# Altium schematic sheet Power.SchDoc
size A; SheetNumber: 8; SheetTotal: 8
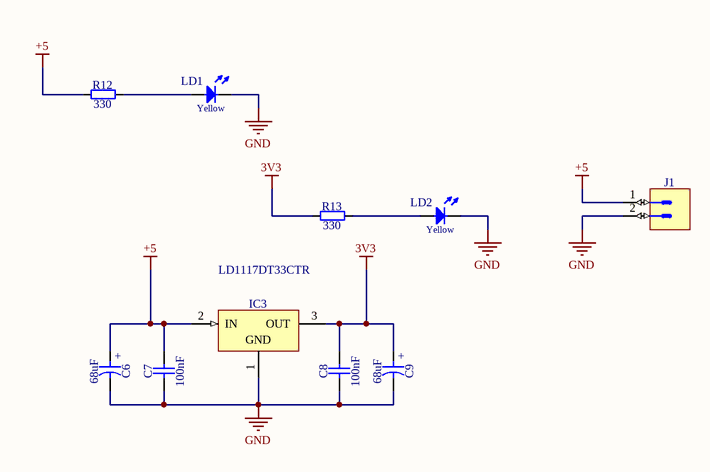
[diagram p0: Power.SchDoc]

## Parts
C6  68uF  [CAPAE660X540N]
C7  100nF  [CAPC2012X135N]
C8  100nF  [CAPC2012X135N]
C9  68uF  [CAPAE660X540N]
IC3  LD1117DT33CTR  [TO228P972X240-3N-R540X510]
J1  Header 2  [JST_B2B-XH-A(LF)(SN)]  (value not drawn)
LD1  Yellow  [LED_3MM_YELLOW_1C-2A]
LD2  Yellow  [LED_3MM_YELLOW_1C-2A]
R12  330  [RESC2012X60N]
R13  330  [RESC2012X60N]

## Nets
3V3: C8.2 C9.1 IC3.3(OUT) R13.1
+5: C6.1 C7.2 IC3.2(IN) J1.1 R12.1
GND: C6.2 C7.1 C8.1 C9.2 IC3.1(GND) J1.2 LD1.1(C) LD2.1(C)
NetLD1_2: LD1.2(A) R12.2
NetLD2_2: LD2.2(A) R13.2

## Notes on the sheet
- (in symbol CAE660-540_220UF_6.3V_20%) +

## Library data of the parts
C6 C9 = CAE660-540_220UF_6.3V_20%: Polarised capacitor; Part Description: Aluminum Electrolytic SMT Capacitor; Manufacturer: PANASONIC; Manufacturer Part Number: EEEFK0J221AP; Voltage: 6.3V; Tolerance: ±20%; Part Number: CAE660-540_220UF_6.3V_20%; Component Kind: Standard; Component Type: Standard; Pin Count: 2; Value: 68uF; Status: Not Recommended; Case: D; Mounted: Yes; Socket: No; SMD: Yes; Sense: No; ComponentHeight: 5.8mm; HelpURL: \\cern.ch\dfs\Applications\Altium\Datasheets\CAE_PANASONIC_FK-V.pdf; Author: CERN DEM JLC; CreateDate: 12/3/2007; LatestRevisionDate: 11/5/2014
C7 C8 = CC0805_100NF_50V_10%_X7R: Non-polarised capacitor; Part Description: SMD Multilayer Chip Ceramic Capacitor; Manufacturer: GENERIC; Manufacturer1 Part Number: C2012X7R1H104K085; Voltage: 50V; TC: X7R; Tolerance: ±10%; Part Number: CC0805_100NF_50V_10%_X7R; Component Kind: Standard; Component Type: Standard; Pin Count: 2; Value: 100nF; Status: None; Manufacturer Part Number: CC0805_100NF_50V_10%_X7R; Case: 0805; Mounted: Yes; Socket: No; SMD: Yes; Sense: No; Manufacturer1 Example: TDK; Manufacturer1 ComponentHeight: 1mm; HelpURL: \\cern.ch\dfs\Applications\Altium\Datasheets\CC0805_X7R_TDK_C.pdf; Author: CERN DEM JLC; CreateDate: 12/3/2007; LatestRevisionDate: 4/22/2015
IC3 = LD1117DT33CTR: 3-Terminal Regulator 1=GND 2=IN 3=OUT; Part Description: 3.3V 800mA Low drop fixed and adjustable positive voltage regulators; Manufacturer: ST MICROELECTRONICS; PressFit: No; Bonding: No; Part Number: LD1117DT33CTR; Component Kind: Standard; Component Type: Standard; Device: LD1117DT33CTR; PackageDescription: TO-252 DPAK TO, 2.28mm Pitch; 2 Pin, 9.725mm L X 6.10mm W X 2.40mm H body, IPC Medium Density; Manufacturer Part Number: LD1117DT33CTR; Pin Count: 3; Case: DPAK; Mounted: Yes; Socket: No; SMD: Yes; Sense: No; ComponentHeight: 2.4mm; HelpURL: \\cern.ch\dfs\Applications\Altium\Datasheets\LD1117DT33CTR.pdf; Author: CERN DEM JLC; CreateDate: 6/8/2011; LatestRevisionDate: 6/8/2011
J1 = JST_B2B-XH-A(LF)(SN): Connector 2 Male; Part Description: 2 Contacts, 2.5mm Pitch, Top Entry Type Shrouded Header; Manufacturer: JST (JAPAN SOLDERLESS TERMINALS); PressFit: No; Part Number: JST_B2B-XH-A(LF)(SN); Component Kind: Standard; Component Type: Standard; Pin Count: 2; Family: Header 2; Mounted: Yes; Socket: No; SMD: No; Sense: No; Status: None; Manufacturer Part Number: B2B-XH-A(LF)(SN); ComponentHeight: 7mm; HelpURL: \\cern.ch\dfs\Applications\Altium\Datasheets\JST_B2B-XH-A(LF)(SN).pdf; Author: CERN DEM JLC; CreateDate: 8/14/2014; LatestRevisionDate: 8/14/2014
LD1 LD2 = LED_AVAGO_HLMP-1719: LED Yellow 1C 2A; Part Description: 3mm Yellow LED; Manufacturer: AVAGO TECHNOLOGIES; PressFit: No; Bonding: No; Part Number: LED_AVAGO_HLMP-1719; Component Kind: Standard; Component Type: Standard; Color: Yellow; PackageDescription: LED, Yellow, Body Dia. 3.43 mm, Pin spacing 2.54mm; Manufacturer Part Number: HLMP-1719; Pin Count: 2; Mounted: Yes; Socket: No; SMD: No; Sense: No; ComponentHeight: 6.35mm(min); HelpURL: \\cern.ch\dfs\Applications\Altium\Datasheets\LED_AVAGO_HLMP-1719.pdf; Author: CERN DEM JLC; CreateDate: 6/12/2008; LatestRevisionDate: 3/17/2010
R12 R13 = R0805_24K_1%_0.125W_100PPM: Resistor - 1%; Part Description: General Purpose Thick Film Chip Resistor; Manufacturer: GENERIC; Manufacturer1 Part Number: NRC10F2402TRF; Power: 0.125W; TC: ±100ppm/°C; PressFit: No; Part Number: R0805_24K_1%_0.125W_100PPM; Component Kind: Standard; Component Type: Standard; Pin Count: 2; Value: 330; Status: Preferred; Tolerance: ±1%; Manufacturer Part Number: R0805_24K_1%_0.125W_100PPM; Case: 0805; Mounted: Yes; Sense: No; Socket: No; SMD: Yes; HelpURL: \\cern.ch\dfs\Applications\Altium\Datasheets\R0805_NIC_NRC.pdf; Author: CERN DEM JLC; CreateDate: 12/3/2007; LatestRevisionDate: 3/13/2008; Manufacturer1 Example: NIC COMPONENT; Manufacturer1 ComponentHeight: 0.6mm